# EAGLE schematic alexandra (EAGLE 7.5.0)
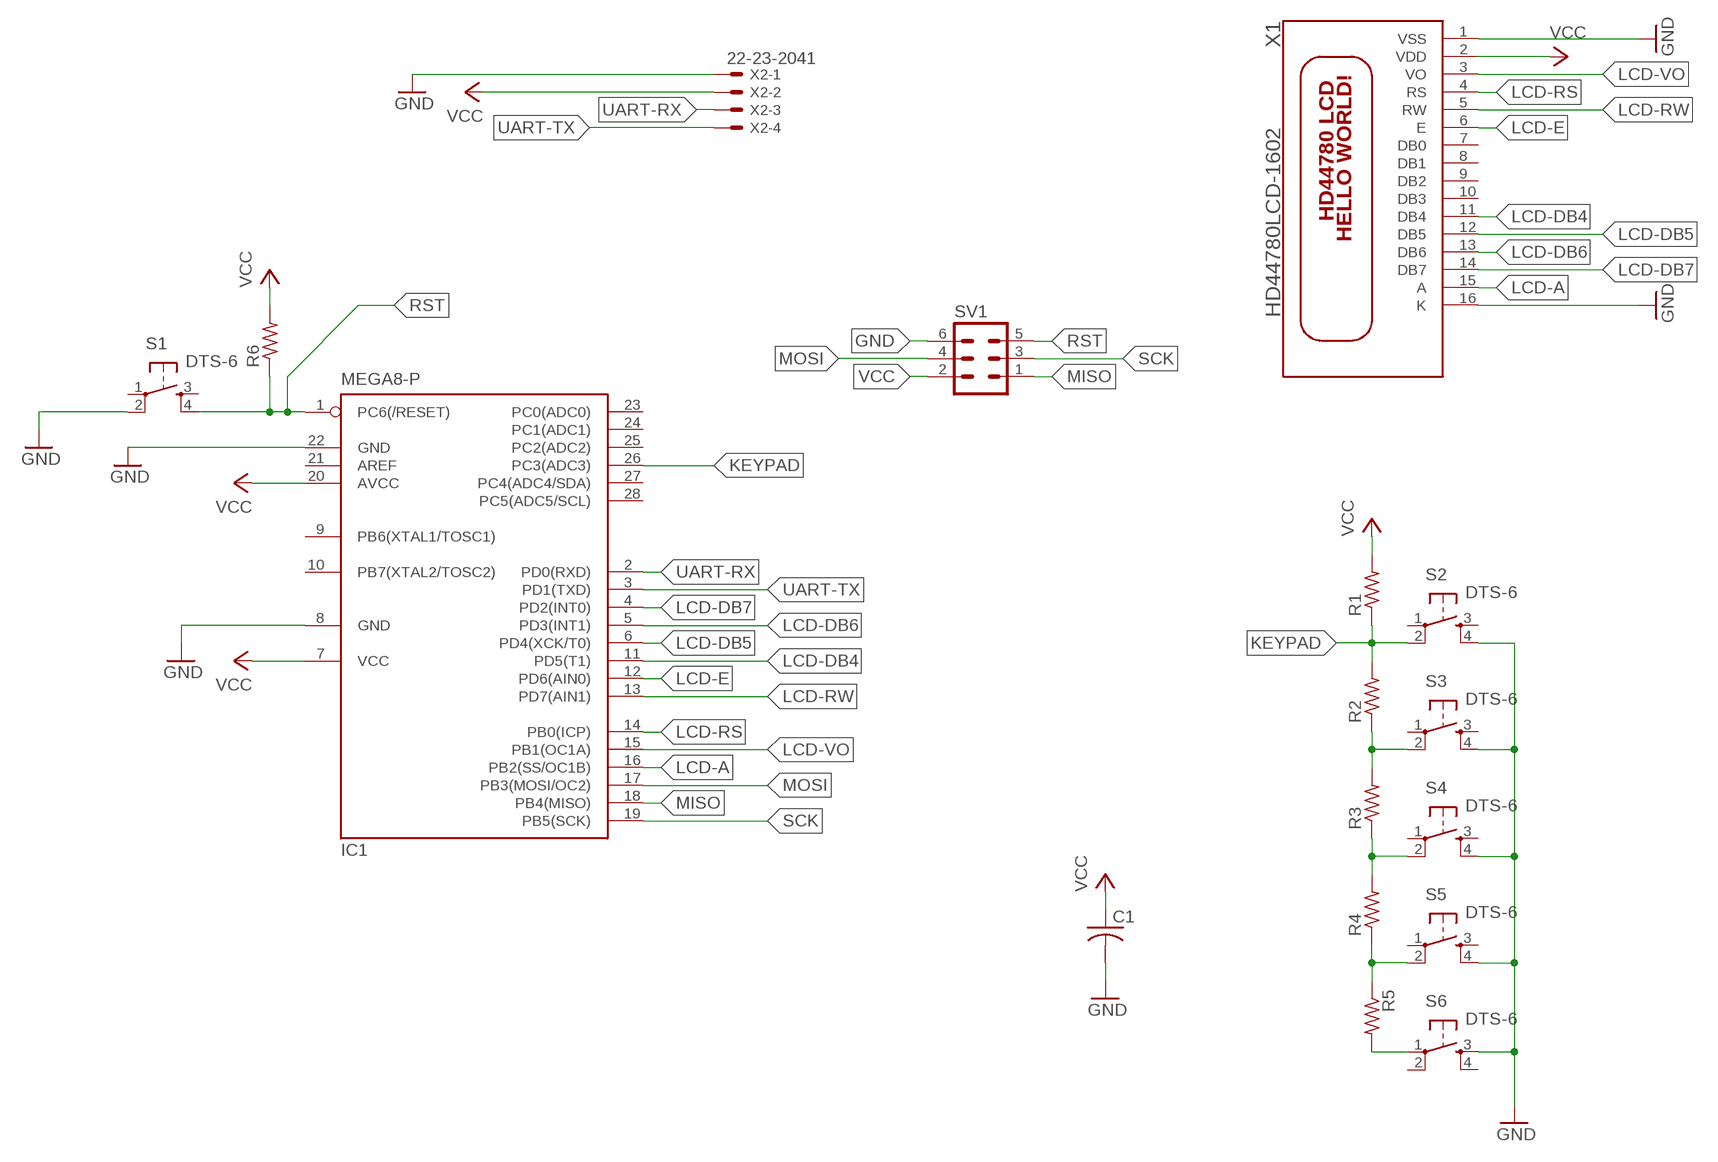
[diagram p0: schematic, sheet 1]

## Parts
C1  C-USC0402  [C0402]
IC1  MEGA8-P  [DIL28-3]
R1  R-US_M1206  [M1206]
R2  R-US_M1206  [M1206]
R3  R-US_M1206  [M1206]
R4  R-US_M1206  [M1206]
R5  R-US_M1206  [M1206]
R6  R-US_M1206  [M1206]
S1  DTS-6  [DTS-6]
S2  DTS-6  [DTS-6]
S3  DTS-6  [DTS-6]
S4  DTS-6  [DTS-6]
S5  DTS-6  [DTS-6]
S6  DTS-6  [DTS-6]
SV1  MA03-2  [MA03-2]
X1  HD44780LCD-1602  [LCD1602]
X2  22-23-2041  [22-23-2041]

## Nets
GND: C1.2 IC1.8(GND) IC1.22(GND) S1.2 S2.4 S3.4 S4.4 S5.4 S6.3 SV1.6 X1.16(K) X2.1
KEYPAD: IC1.26(PC3(ADC3)) R1.1 R2.2 S2.2
LCD-A: IC1.16(PB2(SS/OC1B)) X1.15(A)
LCD-DB4: IC1.11(PD5(T1)) X1.11(DB4)
LCD-DB5: IC1.6(PD4(XCK/T0)) X1.12(DB5)
LCD-DB6: IC1.5(PD3(INT1)) X1.13(DB6)
LCD-DB7: IC1.4(PD2(INT0)) X1.14(DB7)
LCD-E: IC1.12(PD6(AIN0)) X1.6(E)
LCD-RS: IC1.14(PB0(ICP)) X1.4(RS)
LCD-RW: IC1.13(PD7(AIN1)) X1.5(RW)
LCD-VO: IC1.15(PB1(OC1A)) X1.3(VO)
MISO: SV1.1
MOSI: SV1.4
N$2: R5.2 S6.1
N$3: R2.1 R3.2 S3.2
N$4: R3.1 R4.2 S4.2
N$5: R4.1 R5.1 S5.2
RST: IC1.1(PC6(/RESET)) R6.1 S1.4 SV1.5
SCK: IC1.19(PB5(SCK)) SV1.3
UART-RX: IC1.2(PD0(RXD)) X2.3
UART-TX: IC1.3(PD1(TXD)) X2.4
VCC: C1.1 IC1.7(VCC) IC1.20(AVCC) R1.2 R6.2 SV1.2 X1.2(VDD) X2.2
VSS: X1.1(VSS) ; supply symbol labelled GND
Unconnected: IC1.9(PB6(XTAL1/TOSC1)) IC1.10(PB7(XTAL2/TOSC2)) IC1.17(PB3(MOSI/OC2)) IC1.18(PB4(MISO)) IC1.21(AREF) IC1.23(PC0(ADC0)) IC1.24(PC1(ADC1)) IC1.25(PC2(ADC2)) IC1.27(PC4(ADC4/SDA)) IC1.28(PC5(ADC5/SCL)) S1.1 S1.3 S2.1 S2.3 S3.1 S3.3 S4.1 S4.3 S5.1 S5.3 S6.2 S6.4 X1.7(DB0) X1.8(DB1) X1.9(DB2) X1.10(DB3)

## Library data of the parts
C1 = adafruit:C-US: CAPACITOR, American symbol
IC1 = atmel:MEGA8-P: MICROCONTROLLER 8 Kbytes FLASH, 1 kbytes SRAM, 512 bytes EEPROM, USART, 4-channel 10 bit ADC, 2-channel 8 bit ADC Pin compatible with Atmega48, ATMega88, ATMega168 Source: avr.lbr; OC_FARNELL: unknown; OC_NEWARK: unknown
R1-R6 = adafruit:R-US_: RESISTOR, American symbol
S1-S6 = switch-tact:DTS-6
SV1 = con-lstb:MA03-2: PIN HEADER; OC_FARNELL: unknown; OC_NEWARK: unknown
X1 = adafruit:HD44780LCD: HD44780 LCD Standard character type LCDs, available in sizes from 8x1 to 40x4!
X2 = con-molex:22-23-2041: .100" (2.54mm) Center Header - 4 Pin; MF: MOLEX; MPN: 22-23-2041; OC_FARNELL: 1462920; OC_NEWARK: 38C0355